# Altium schematic sheet MODULE_1.SchDoc
size B
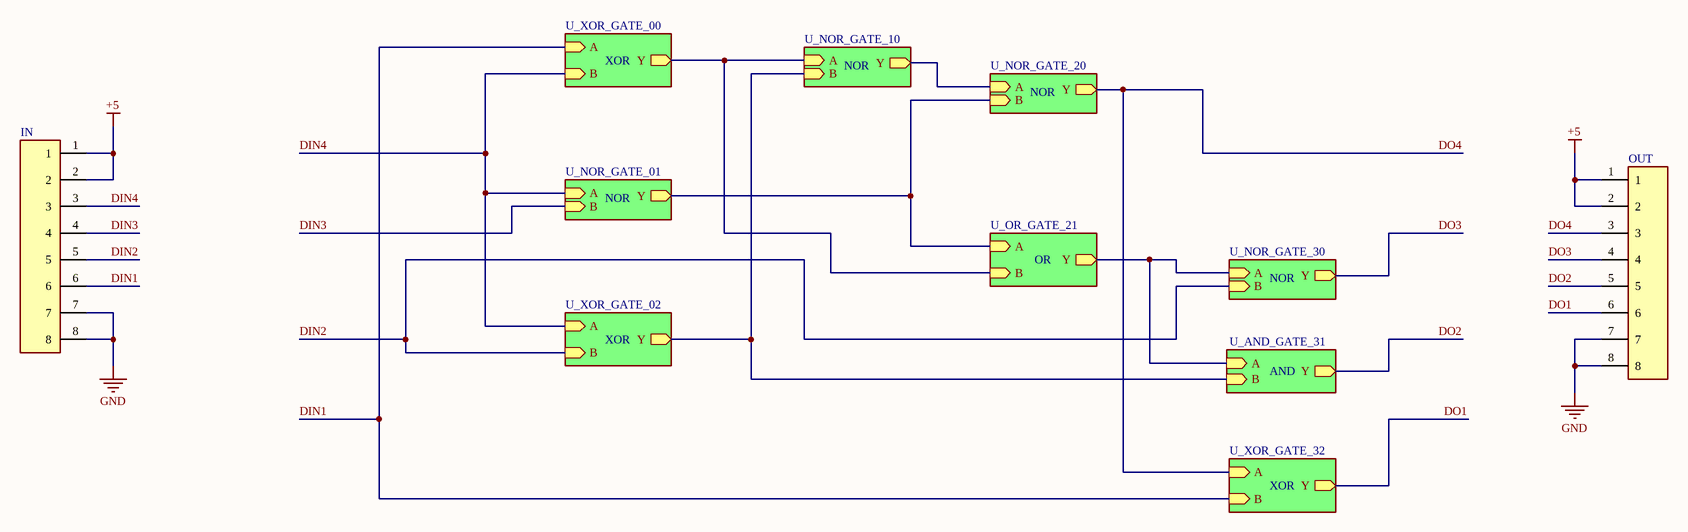
[diagram p0: MODULE_1.SchDoc]

## Parts
IN  2.54mm_TH_1x8_pin_header  [2.54mm_TH_1x8_pin_header]  (value not drawn)
OUT  2.54mm_TH_1x8_pin_header  [2.54mm_TH_1x8_pin_header]  (value not drawn)

## Sub-sheets
U_AND_GATE_31 = AND_GATE.SchDoc: Y (out), A (in), B (in)
U_NOR_GATE_01 = NOR_GATE.SchDoc: Y (out), A (in), B (in)
U_NOR_GATE_10 = NOR_GATE.SchDoc: Y (out), A (in), B (in)
U_NOR_GATE_20 = NOR_GATE.SchDoc: Y (out), A (in), B (in)
U_NOR_GATE_30 = NOR_GATE.SchDoc: Y (out), A (in), B (in)
U_OR_GATE_21 = OR_GATE.SchDoc: Y (out), A (in), B (in)
U_XOR_GATE_00 = XOR_GATE.SchDoc: Y (out), A (in), B (in)
U_XOR_GATE_02 = XOR_GATE.SchDoc: Y (out), A (in), B (in)
U_XOR_GATE_32 = XOR_GATE.SchDoc: Y (out), A (in), B (in)

## Nets
+5: IN.1 IN.2 OUT.1 OUT.2
GND: IN.7 IN.8 OUT.7 OUT.8
DIN1: IN.6 ; sheet U_XOR_GATE_00/A, sheet U_XOR_GATE_32/B
DIN2: IN.5 ; sheet U_XOR_GATE_02/B, sheet U_NOR_GATE_30/B
DIN3: IN.4 ; sheet U_NOR_GATE_01/B
DIN4: IN.3 ; sheet U_XOR_GATE_02/A, sheet U_NOR_GATE_01/A, sheet U_XOR_GATE_00/B
DO1: OUT.6 ; sheet U_XOR_GATE_32/Y
DO2: OUT.5 ; sheet U_AND_GATE_31/Y
DO3: OUT.4 ; sheet U_NOR_GATE_30/Y
DO4: OUT.3 ; sheet U_NOR_GATE_20/Y, sheet U_XOR_GATE_32/A
(unnamed): sheet U_XOR_GATE_02/Y, sheet U_AND_GATE_31/B, sheet U_NOR_GATE_10/B
(unnamed): sheet U_OR_GATE_21/Y, sheet U_AND_GATE_31/A, sheet U_NOR_GATE_30/A
(unnamed): sheet U_OR_GATE_21/A, sheet U_NOR_GATE_01/Y, sheet U_NOR_GATE_20/B
(unnamed): sheet U_OR_GATE_21/B, sheet U_XOR_GATE_00/Y, sheet U_NOR_GATE_10/A
(unnamed): sheet U_NOR_GATE_10/Y, sheet U_NOR_GATE_20/A

## Notes on the sheet
- XOR
- NOR
- OR
- AND

## Library data of the parts
IN OUT = 2.54mm_TH_1x8_pin_header: System: Connector